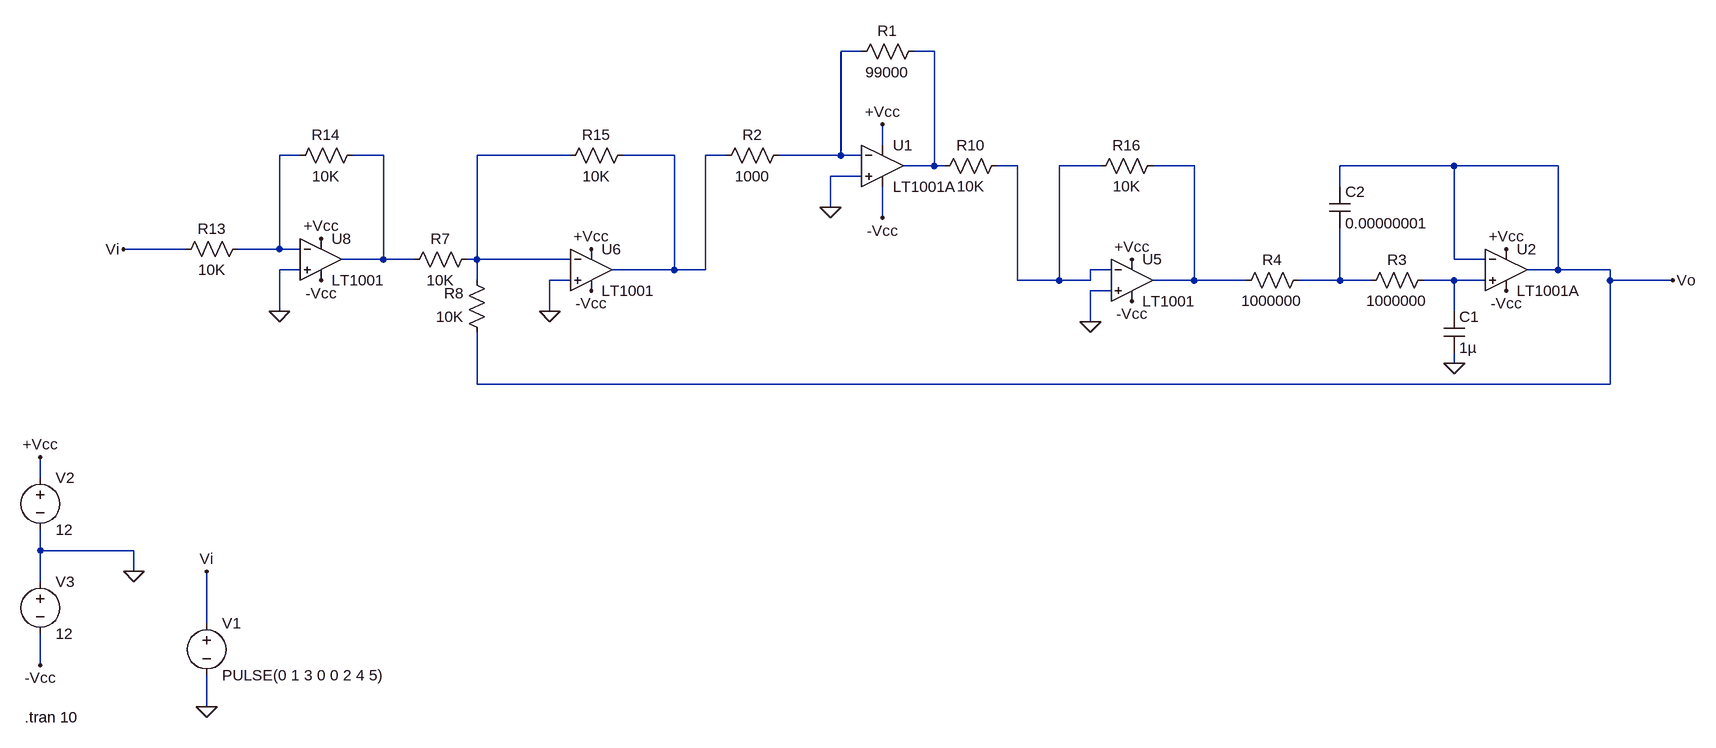
[diagram p0: schematic Circuito_P.asc]
Circuito_P.asc, the LTspice schematic file:
Version 4
SHEET 1 1532 1072
WIRE -688 32 -720 32
WIRE -576 32 -608 32
WIRE -656 176 -656 144
WIRE -1552 192 -1584 192
WIRE -1424 192 -1472 192
WIRE -1136 192 -1280 192
WIRE -976 192 -1056 192
WIRE -896 192 -928 192
WIRE -720 192 -720 32
WIRE -720 192 -816 192
WIRE -688 192 -720 192
WIRE -576 208 -576 32
WIRE -576 208 -624 208
WIRE -560 208 -576 208
WIRE -448 208 -480 208
WIRE -320 208 -384 208
WIRE -176 208 -240 208
WIRE 224 208 48 208
WIRE 384 208 224 208
WIRE -688 224 -736 224
WIRE 48 240 48 208
WIRE -736 272 -736 224
WIRE -656 288 -656 240
WIRE -1728 336 -1824 336
WIRE -1584 336 -1584 192
WIRE -1584 336 -1648 336
WIRE -1552 336 -1584 336
WIRE -1424 352 -1424 192
WIRE -1424 352 -1488 352
WIRE -1376 352 -1424 352
WIRE -1280 352 -1280 192
WIRE -1280 352 -1296 352
WIRE -1136 352 -1280 352
WIRE 224 352 224 208
WIRE 272 352 224 352
WIRE -1552 368 -1584 368
WIRE -976 368 -976 192
WIRE -976 368 -1072 368
WIRE -928 368 -928 192
WIRE -928 368 -976 368
WIRE -304 368 -336 368
WIRE 384 368 384 208
WIRE 384 368 336 368
WIRE 464 368 384 368
WIRE -1280 384 -1280 352
WIRE -1136 384 -1168 384
WIRE -448 384 -448 208
WIRE -384 384 -384 208
WIRE -384 384 -448 384
WIRE -336 384 -336 368
WIRE -336 384 -384 384
WIRE -176 384 -176 208
WIRE -176 384 -240 384
WIRE -96 384 -176 384
WIRE 48 384 48 304
WIRE 48 384 -16 384
WIRE 96 384 48 384
WIRE 224 384 176 384
WIRE 272 384 224 384
WIRE 464 384 464 368
WIRE 560 384 464 384
WIRE -304 400 -336 400
WIRE -1584 432 -1584 368
WIRE -1168 432 -1168 384
WIRE 224 432 224 384
WIRE -336 448 -336 400
WIRE 224 512 224 496
WIRE -1280 544 -1280 464
WIRE 464 544 464 384
WIRE 464 544 -1280 544
WIRE -1952 688 -1952 656
WIRE -1952 800 -1952 768
WIRE -1808 800 -1952 800
WIRE -1808 832 -1808 800
WIRE -1952 848 -1952 800
WIRE -1696 912 -1696 832
WIRE -1952 976 -1952 928
WIRE -1696 1040 -1696 992
FLAG -736 272 0
FLAG -1696 1040 0
FLAG -1808 832 0
FLAG -1952 656 +Vcc
FLAG -1952 976 -Vcc
FLAG -656 144 +Vcc
FLAG -656 288 -Vcc
FLAG 304 336 +Vcc
FLAG 304 400 -Vcc
FLAG -336 448 0
FLAG -272 352 +Vcc
FLAG -272 416 -Vcc
FLAG -1104 336 +Vcc
FLAG -1104 400 -Vcc
FLAG -1168 432 0
FLAG -1584 432 0
FLAG -1824 336 Vi
FLAG 560 384 Vo
FLAG -1696 832 Vi
FLAG -1520 320 +Vcc
FLAG -1520 384 -Vcc
FLAG 224 512 0
SYMBOL OpAmps\\LT1001A -656 144 R0
SYMATTR InstName U1
SYMBOL res -592 16 R90
WINDOW 0 0 56 VBottom 2
WINDOW 3 32 56 VTop 2
SYMATTR InstName R1
SYMATTR Value 99000
SYMBOL res -800 176 R90
WINDOW 0 0 56 VBottom 2
WINDOW 3 32 56 VTop 2
SYMATTR InstName R2
SYMATTR Value 1000
SYMBOL voltage -1696 896 R0
WINDOW 123 0 0 Left 0
WINDOW 39 0 0 Left 0
SYMATTR InstName V1
SYMATTR Value PULSE(0 1 3 0 0 2 4 5)
SYMBOL voltage -1952 672 R0
WINDOW 123 0 0 Left 0
WINDOW 39 0 0 Left 0
SYMATTR InstName V2
SYMATTR Value 12
SYMBOL voltage -1952 832 R0
WINDOW 123 0 0 Left 0
WINDOW 39 0 0 Left 0
SYMATTR InstName V3
SYMATTR Value 12
SYMBOL OpAmps\\LT1001A 304 304 R0
SYMATTR InstName U2
SYMBOL res 192 368 R90
WINDOW 0 0 56 VBottom 2
WINDOW 3 32 56 VTop 2
SYMATTR InstName R3
SYMATTR Value 1000000
SYMBOL res 0 368 R90
WINDOW 0 0 56 VBottom 2
WINDOW 3 32 56 VTop 2
SYMATTR InstName R4
SYMATTR Value 1000000
SYMBOL cap 208 432 R0
SYMATTR InstName C1
SYMATTR Value 1µ
SYMBOL cap 32 240 R0
SYMATTR InstName C2
SYMATTR Value 0.00000001
SYMBOL OpAmps\\LT1001 -272 320 R0
SYMATTR InstName U5
SYMBOL OpAmps\\LT1001 -1104 304 R0
SYMATTR InstName U6
SYMBOL res -1280 336 R90
WINDOW 0 0 56 VBottom 2
WINDOW 3 32 56 VTop 2
SYMATTR InstName R7
SYMATTR Value 10K
SYMBOL res -1264 480 R180
WINDOW 0 36 76 Left 2
WINDOW 3 36 40 Left 2
SYMATTR InstName R8
SYMATTR Value 10K
SYMBOL res -464 192 R90
WINDOW 0 0 56 VBottom 2
WINDOW 3 32 56 VTop 2
SYMATTR InstName R10
SYMATTR Value 10K
SYMBOL OpAmps\\LT1001 -1520 288 R0
SYMATTR InstName U8
SYMBOL res -1632 320 R90
WINDOW 0 0 56 VBottom 2
WINDOW 3 32 56 VTop 2
SYMATTR InstName R13
SYMATTR Value 10K
SYMBOL res -1456 176 R90
WINDOW 0 0 56 VBottom 2
WINDOW 3 32 56 VTop 2
SYMATTR InstName R14
SYMATTR Value 10K
SYMBOL res -1040 176 R90
WINDOW 0 0 56 VBottom 2
WINDOW 3 32 56 VTop 2
SYMATTR InstName R15
SYMATTR Value 10K
SYMBOL res -224 192 R90
WINDOW 0 0 56 VBottom 2
WINDOW 3 32 56 VTop 2
SYMATTR InstName R16
SYMATTR Value 10K
TEXT -1976 1056 Left 2 !.tran 10

The netlist it stands for:
* Circuito_P.asc
XU1 0 N001 +Vcc -Vcc N002 LT1001  ; LT1001A, pins In+ In- V+ V- OUT
R1 N002 N001 99000
R2 N001 N006 1000
V1 Vi 0 PULSE(0 1 3 0 0 2 4 5)
V2 +Vcc 0 12
V3 0 -Vcc 12
XU2 N010 Vo +Vcc -Vcc Vo LT1001  ; LT1001A, pins In+ In- V+ V- OUT
R3 N010 N009 1000000
R4 N009 N008 1000000
C1 N010 0 1µ
C2 Vo N009 0.00000001
XU5 0 N007 +Vcc -Vcc N008 LT1001  ; pins In+ In- V+ V- OUT
XU6 0 N005 +Vcc -Vcc N006 LT1001  ; pins In+ In- V+ V- OUT
R7 N005 N004 10K
R8 Vo N005 10K
R10 N007 N002 10K
XU8 0 N003 +Vcc -Vcc N004 LT1001  ; pins In+ In- V+ V- OUT
R13 N003 Vi 10K
R14 N004 N003 10K
R15 N006 N005 10K
R16 N008 N007 10K
.tran 10
.lib LTC.lib
.backanno
.end